# Altium project PCB_Tx.PrjPcb
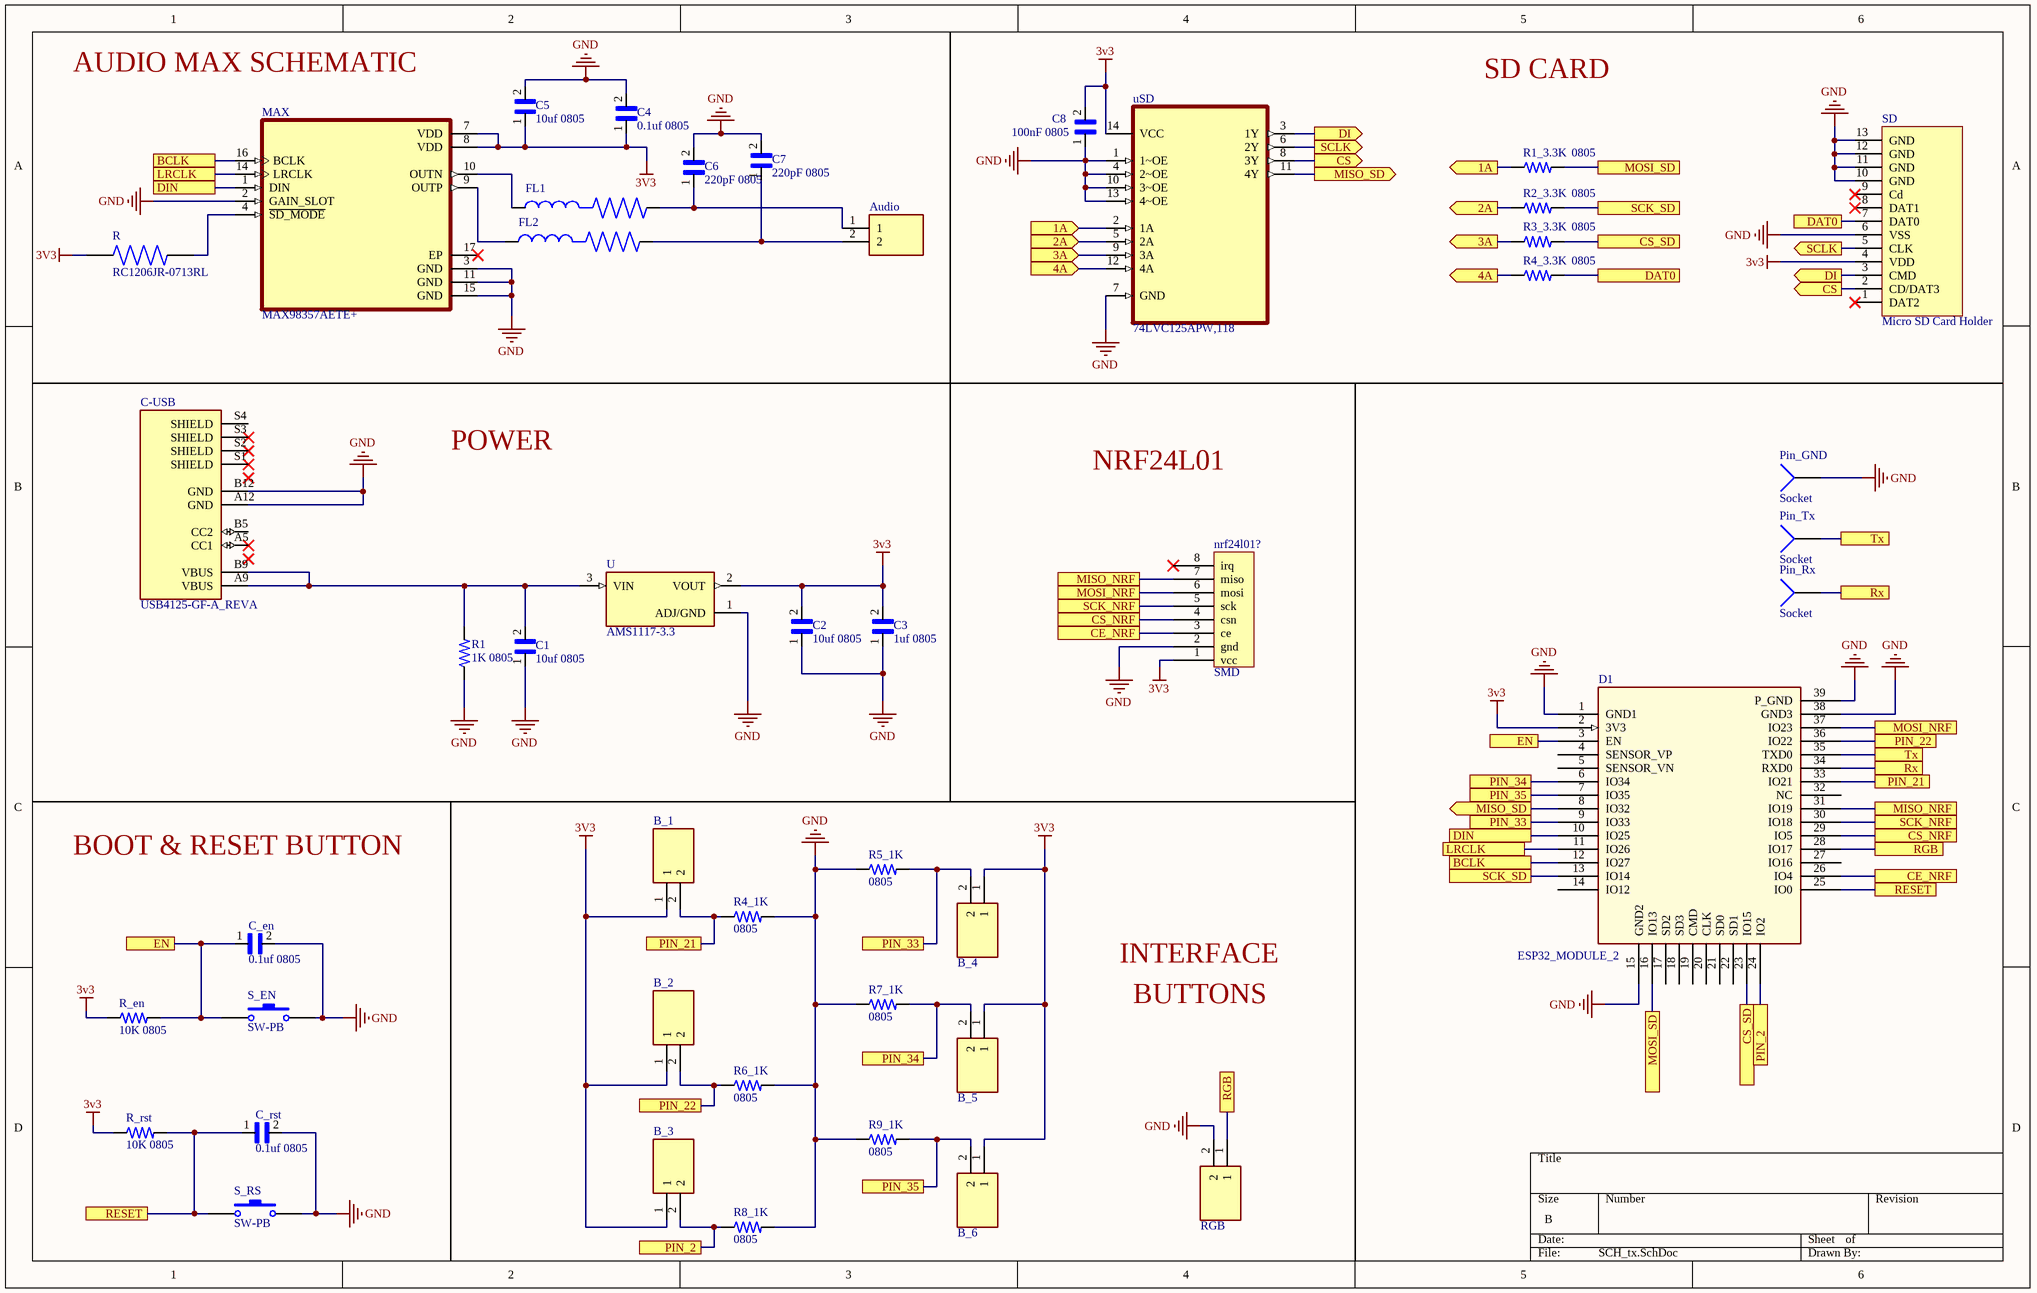
[diagram p0: SCH_tx.SchDoc]
1 sheet, 46 parts. Net scope: flat (ports and power ports of the same name join across sheets).
Board files: PCB_Tx.PcbDoc, PCB_TX_N.PcbDoc

## Sheet SCH_tx.SchDoc
size B; SheetNumber: 1; SheetTotal: 2

### Parts
Audio  (no value)  [JST_B2B-XH-A(LF)(SN)]
B_1  (no value)  [JST_B2B-XH-A(LF)(SN)]
B_2  (no value)  [JST_B2B-XH-A(LF)(SN)]
B_3  (no value)  [JST_B2B-XH-A(LF)(SN)]
B_4  (no value)  [JST_B2B-XH-A(LF)(SN)]
B_5  (no value)  [JST_B2B-XH-A(LF)(SN)]
B_6  (no value)  [JST_B2B-XH-A(LF)(SN)]
C1  10uf 0805  [CAPC2012X94N]
C2  10uf 0805  [CAPC2012X94N]
C3  1uf 0805  [CAPC2012X94N]
C4  0.1uf 0805  [CAPC2012X94N]
C5  10uf 0805  [CAPC2012X94N]
C6  220pF 0805  [CAPC2012X94N]
C7  220pF 0805  [CAPC2012X94N]
C8  100nF 0805  [CAPC2012X94N]
C-USB  USB4125-GF-A_REVA  [GCT_USB4125-GF-A_REVA]
C_en  0.1uf 0805  [CAPC2012X94N]
C_rst  0.1uf 0805  [CAPC2012X94N]
D1  ESP32_MODULE_2  [XCVR_ESP32-WROOM-32U]
FL1  (no value)  [BEADC2012X105N]
FL2  (no value)  [BEADC2012X105N]
MAX  MAX98357AETE+  [QFN50P300X300X80-17N]
nrf24l01?  SMD  [NRF24L01]
Pin_GND  Socket  [PIN1]
Pin_Rx  Socket  [PIN1]
Pin_Tx  Socket  [PIN1]
R  RC1206JR-0713RL  [RESC3116X65N]
R1  1K 0805  [RESC2012X65N]
R1_3.3K  0805  [RESC2012X65N]
R2_3.3K  0805  [RESC2012X65N]
R3_3.3K  0805  [RESC2012X65N]
R4_1K  0805  [RESC2012X65N]
R4_3.3K  0805  [RESC2012X65N]
R5_1K  0805  [RESC2012X65N]
R6_1K  0805  [RESC2012X65N]
R7_1K  0805  [RESC2012X65N]
R8_1K  0805  [RESC2012X65N]
R9_1K  0805  [RESC2012X65N]
R_en  10K 0805  [RESC2012X65N]
R_rst  10K 0805  [RESC2012X65N]
RGB  (no value)  [JST_B2B-XH-A(LF)(SN)]
S_EN  SW-PB  [SKRK]
S_RS  SW-PB  [SKRK]
SD  Micro SD Card Holder  [Micro SD Card Holder]
U  AMS1117-3.3  [SOT229P700X180-4N]
uSD  74LVC125APW,118  [SOP65P640X110-14N]

### Ports
1A (in), 1A (out), 2A (in), 2A (out), 3A (in), 3A (out), 4A (in), 4A (out), BCLK, CE_NRF, CS (out), CS_NRF, CS_SD, DAT0, DI (out), DIN, EN, LRCLK, MISO_NRF, MISO_SD (out), MOSI_NRF, MOSI_SD, PIN_2, PIN_21, PIN_22, PIN_33, PIN_34, PIN_35, RESET, RGB, Rx, SCK_NRF, SCK_SD, SCLK (out), Tx

### Nets
3v3: B_1.1 B_2.1 B_3.1 B_4.1 B_5.1 B_6.1 C2.2 C3.2 C4.1 C5.1 C8.2 D1.2(3V3) MAX.7(VDD) MAX.8(VDD) nrf24l01?.1(vcc) R.1 R_en.1 R_rst.1 SD.4(VDD) U.2(VOUT) uSD.14(VCC)
GND: C1.1 C2.1 C3.1 C4.2 C5.2 C6.2 C7.2 C8.1 C-USB.A12(GND) C-USB.B12(GND) C_en.2 C_rst.2 D1.1(GND1) D1.15(GND2) D1.38(GND3) D1.39(P_GND) MAX.2(GAIN_SLOT) MAX.3(GND) MAX.11(GND) MAX.15(GND) nrf24l01?.2(gnd) Pin_GND.1 R1.1 R4_1K.2 R5_1K.1 R6_1K.2 R7_1K.1 R8_1K.2 R9_1K.1 RGB.2 S_EN.2 S_RS.2 SD.6(VSS) SD.10(GND) SD.11(GND) SD.12(GND) SD.13(GND) U.1(ADJ/GND) uSD.1(1~OE) uSD.4(2~OE) uSD.7(GND) uSD.10(3~OE) uSD.13(4~OE)
NetAudio_1: Audio.1 C6.1 FL1.2
NetAudio_2: Audio.2 C7.1 FL2.2
NetB_1_2: B_1.2 D1.33(IO21) R4_1K.1 ; port PIN_21
NetB_2_2: B_2.2 D1.36(IO22) R6_1K.1 ; port PIN_22
NetB_3_2: B_3.2 D1.24(IO2) R8_1K.1 ; port PIN_2
NetB_4_2: B_4.2 D1.9(IO33) R5_1K.2 ; port PIN_33
NetB_5_2: B_5.2 D1.6(IO34) R7_1K.2 ; port PIN_34
NetB_6_2: B_6.2 D1.7(IO35) R9_1K.2 ; port PIN_35
NetC1_2: C1.2 C-USB.A9(VBUS) C-USB.B9(VBUS) R1.2 U.3(VIN)
NetC_en_1: C_en.1 D1.3(EN) R_en.2 S_EN.1 ; port EN
NetC_rst_1: C_rst.1 D1.25(IO0) R_rst.2 S_RS.1 ; port RESET
NetD1_8: D1.8(IO32) uSD.11(4Y) ; port MISO_SD
NetD1_10: D1.10(IO25) MAX.1(DIN) ; port DIN
NetD1_11: D1.11(IO26) MAX.14(LRCLK) ; port LRCLK
NetD1_12: D1.12(IO27) MAX.16(BCLK) ; port BCLK
NetD1_13: D1.13(IO14) R2_3.3K.2 ; port SCK_SD
NetD1_16: D1.16(IO13) R1_3.3K.2 ; port MOSI_SD
NetD1_23: D1.23(IO15) R3_3.3K.2 ; port CS_SD
NetD1_26: D1.26(IO4) nrf24l01?.3(ce) ; port CE_NRF
NetD1_28: D1.28(IO17) RGB.1 ; port RGB
NetD1_29: D1.29(IO5) nrf24l01?.4(csn) ; port CS_NRF
NetD1_30: D1.30(IO18) nrf24l01?.5(sck) ; port SCK_NRF
NetD1_31: D1.31(IO19) nrf24l01?.7(miso) ; port MISO_NRF
NetD1_34: D1.34(RXD0) Pin_Rx.1 ; port Rx
NetD1_35: D1.35(TXD0) Pin_Tx.1 ; port Tx
NetD1_37: D1.37(IO23) nrf24l01?.6(mosi) ; port MOSI_NRF
NetFL1_1: FL1.1 MAX.10(OUTN)
NetFL2_1: FL2.1 MAX.9(OUTP)
NetMAX_4: MAX.4(~{SD_MODE}) R.2
NetR1_3.3K_1: R1_3.3K.1 uSD.2(1A) ; port 1A
NetR2_3.3K_1: R2_3.3K.1 uSD.5(2A) ; port 2A
NetR3_3.3K_1: R3_3.3K.1 uSD.9(3A) ; port 3A
NetR4_3.3K_1: R4_3.3K.1 uSD.12(4A) ; port 4A
NetR4_3.3K_2: R4_3.3K.2 SD.7(DAT0) ; port DAT0
NetSD_2: SD.2(CD/DAT3) uSD.8(3Y) ; port CS
NetSD_3: SD.3(CMD) uSD.3(1Y) ; port DI
NetSD_5: SD.5(CLK) uSD.6(2Y) ; port SCLK

Not connected (* = marked no-connect by the designer): C-USB A5(CC1)* B5(CC2) S1(SHIELD)* S2(SHIELD)* S3(SHIELD)* S4(SHIELD); D1 4(SENSOR_VP) 5(SENSOR_VN) 14(IO12) 17(SD2) 18(SD3) 19(CMD) 20(CLK) 21(SD0) 22(SD1) 27(IO16) 32(NC); MAX 17(EP)*; nrf24l01? 8(irq)*; SD 1(DAT2)* 8(DAT1)* 9(Cd)*

### Notes on the sheet
- AUDIO MAX SCHEMATIC
- SD CARD
- POWER
- NRF24L01
- BOOT & RESET BUTTON
- INTERFACE
- BUTTONS

### Library data of the parts
Audio B_1-B_6 RGB = B2B-XH-A(LF)(SN): Connector Header Through Hole 2 position 0.098 (2.50mm); MF: JST Sales; MP: B2B-XH-A(LF)(SN); SnapEDA_Link: https://www.snapeda.com/parts/B2B-XH-A(LF)(SN)/JST%20Sales%20America%20Inc./view-part/492310/?ref=snap; Availability: In Stock; Check_prices: https://www.snapeda.com/parts/B2B-XH-A(LF)(SN)/JST%20Sales%20America%20Inc./view-part/492310/?ref=eda; Value: *; Purchase-URL: https://pricing.snapeda.com/search/part/B2B-XH-A(LF)(SN)/?ref=eda; Package: None; Price: None
C1-C8 C_en C_rst = 0805YC103J4T2A: 10000pF Â±5% 16V Ceramic Capacitor X7R 0805 _2012 Metric_; MF: AVX; Package: 2012 AVX; Availability: Unavailable; Value: *; MP: 0805YC103J4T2A; SnapEDA_Link: https://www.snapeda.com/parts/0805YC103J4T2A/AVX/view-part/606803/?ref=snap; Price: None
C-USB = USB4125-GF-A_REVA: USB 2.0 Type C Receptacle, Horizontal, SMT, For Power charging; MF: Global Connector Technology; SnapEDA_Link: https://www.snapeda.com/parts/USB4125-GF-A/Global%20Connector%20Technology/view-part/5160675/?ref=snap; Package: None; Check_prices: https://www.snapeda.com/parts/USB4125-GF-A/Global%20Connector%20Technology/view-part/5160675/?ref=eda; MP: USB4125-GF-A; Value: *; Availability: Unavailable; Price: None
FL1 FL2 = BLM21PG221BH1D: Package: None; Price: None; Value: *; MP: BLM21PG221BH1D; Availability: Unavailable
MAX = MAX98357AETE+: Amplifier IC 1-Channel _Mono_ Class D 16-TQFN _3x3_; MF: Maxim Integrated; Price: None; MP: MAX98357AETE+; Value: *; Package: TQFN-16 Maxim; SnapEDA_Link: https://www.snapeda.com/parts/MAX98357AETE%2B/Maxim%20Integrated/view-part/229145/?ref=snap; Availability: Unavailable
nrf24l01? = nrf24l01_smd
R = RC1206JR-0713RL: 13 Ohms Â±5% 0.25W, 1/4W Chip Resistor 1206 _3216 Metric_ Moisture Resistant Thick Film; MF: Yageo; MP: RC1206JR-0713RL; Availability: Unavailable; SnapEDA_Link: https://www.snapeda.com/parts/RC1206JR-0713RL/Yageo/view-part/105893/?ref=snap; Package: 3116 Yageo; Value: *; Price: None
R1 R1_3.3K R2_3.3K R3_3.3K R4_1K R4_3.3K R5_1K R6_1K R7_1K R8_1K R9_1K R_en R_rst = 2-2176053-0: RES 0.33 OHM 1% 1/4W 0805; Resistance: .33; MF: TE Connectivity; Power_Rating: .25 W; Price: None; EU_RoHS_Compliance: Compliant with Exemptions; Tolerance: 1%; MP: 2-2176053-0; Value: *; Availability: Unavailable; SnapEDA_Link: https://www.snapeda.com/parts/2-2176053-0/TE%20Connectivity/view-part/2214508/?ref=snap; Package: 0805
S_EN S_RS = SW-PB: Switch; Published: 24-Mar-1999; LatestRevisionDate: 17-Jul-2002; LatestRevisionNote: Re-released for DXP Platform.; PackageReference: SPST-2; Publisher: Altium Limited; PackageDescription: Switch; 2 Leads
U = AMS1117-3.3: Sot223/Pkg 1-Amp 3.3-Volt Low Drop Out Voltage Regulatator; MF: Advanced Monolithic Systems; Price: None; Package: None; Value: *; MP: AMS1117-3.3; Availability: Unavailable; SnapEDA_Link: https://www.snapeda.com/parts/AMS1117-3.3/Advanced%20Monolithic%20Systems/view-part/53450/?ref=snap
uSD = 74LVC125APW,118: IC BUF NON-INVERT 3.6V 14TSSOP; MF: Nexperia USA Inc.; MP: 74LVC125APW,118; Availability: Good; SnapEDA_Link: https://www.snapeda.com/parts/74LVC125APW,118/Nexperia/view-part/5160321/?ref=snap; Check_prices: https://www.snapeda.com/parts/74LVC125APW,118/Nexperia/view-part/5160321/?ref=eda; Value: *; Purchase-URL: https://pricing.snapeda.com/search/part/74LVC125APW,118/?ref=eda; Package: None; Price: None
Pin_GND Pin_Rx Pin_Tx = Socket: LatestRevisionDate: 17-Jul-2002; LatestRevisionNote: Re-released for DXP Platform.; Publisher: Altium Limited